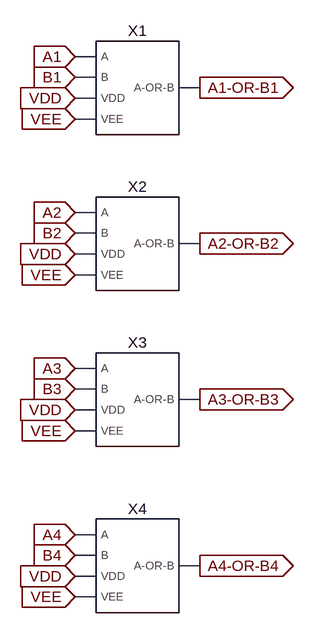
[diagram p0: schematic 4_Bit_OR_Symbol.asc]
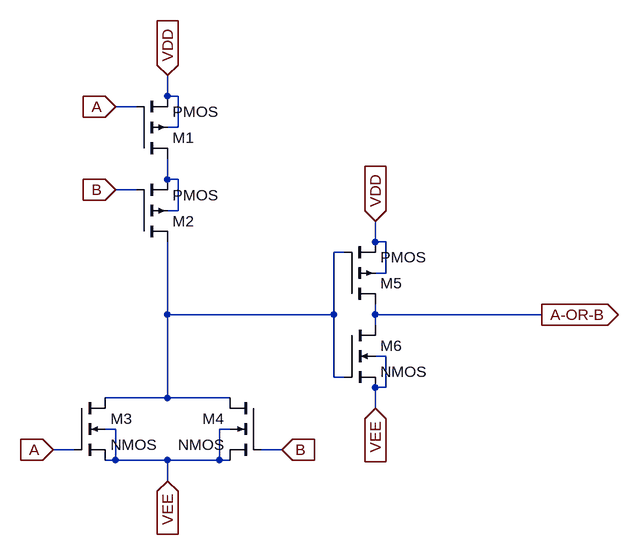
[diagram p1: sub-circuit 2_input_or_gate_symbol.asc]
4_Bit_OR_Symbol.asc, the LTspice schematic file:
Version 4
SHEET 1 1176 844
WIRE 704 -48 672 -48
WIRE 704 -16 672 -16
WIRE 864 0 832 0
WIRE 704 16 672 16
WIRE 704 48 672 48
WIRE 704 192 672 192
WIRE 704 224 672 224
WIRE 864 240 832 240
WIRE 704 256 672 256
WIRE 704 288 672 288
WIRE 704 432 672 432
WIRE 704 464 672 464
WIRE 864 480 832 480
WIRE 704 496 672 496
WIRE 704 528 672 528
WIRE 704 688 672 688
WIRE 704 720 672 720
WIRE 864 736 832 736
WIRE 704 752 672 752
WIRE 704 784 672 784
FLAG 672 -48 A1
IOPIN 672 -48 In
FLAG 672 16 VDD
IOPIN 672 16 In
FLAG 672 256 VDD
IOPIN 672 256 In
FLAG 672 496 VDD
IOPIN 672 496 In
FLAG 672 752 VDD
IOPIN 672 752 In
FLAG 672 -16 B1
IOPIN 672 -16 In
FLAG 672 192 A2
IOPIN 672 192 In
FLAG 672 224 B2
IOPIN 672 224 In
FLAG 672 432 A3
IOPIN 672 432 In
FLAG 672 464 B3
IOPIN 672 464 In
FLAG 672 688 A4
IOPIN 672 688 In
FLAG 672 720 B4
IOPIN 672 720 In
FLAG 864 0 A1-OR-B1
IOPIN 864 0 Out
FLAG 864 240 A2-OR-B2
IOPIN 864 240 Out
FLAG 864 480 A3-OR-B3
IOPIN 864 480 Out
FLAG 864 736 A4-OR-B4
IOPIN 864 736 Out
FLAG 672 48 VEE
IOPIN 672 48 In
FLAG 672 288 VEE
IOPIN 672 288 In
FLAG 672 528 VEE
IOPIN 672 528 In
FLAG 672 784 VEE
IOPIN 672 784 In
SYMBOL 2_Input_OR_Gate_Symbol 768 0 R0
SYMATTR InstName X1
SYMBOL 2_Input_OR_Gate_Symbol 768 240 R0
SYMATTR InstName X2
SYMBOL 2_Input_OR_Gate_Symbol 768 480 R0
SYMATTR InstName X3
SYMBOL 2_Input_OR_Gate_Symbol 768 736 R0
SYMATTR InstName X4

2_input_or_gate_symbol.asc, the sub-circuit schematic file:
Version 4
SHEET 1 1612 1096
WIRE 912 416 912 384
WIRE 928 416 912 416
WIRE 864 432 832 432
WIRE 928 464 928 416
WIRE 928 464 912 464
WIRE 912 544 912 512
WIRE 928 544 912 544
WIRE 864 560 832 560
WIRE 928 592 928 544
WIRE 928 592 912 592
WIRE 1232 640 1232 608
WIRE 1248 640 1232 640
WIRE 1184 656 1168 656
WIRE 1248 688 1248 640
WIRE 1248 688 1232 688
WIRE 912 752 912 640
WIRE 1168 752 1168 656
WIRE 1168 752 912 752
WIRE 1232 752 1232 736
WIRE 1488 752 1232 752
WIRE 1232 768 1232 752
WIRE 1248 816 1232 816
WIRE 1168 848 1168 752
WIRE 1184 848 1168 848
WIRE 1248 864 1248 816
WIRE 1248 864 1232 864
WIRE 912 880 912 752
WIRE 912 880 816 880
WIRE 1008 880 912 880
WIRE 1232 896 1232 864
WIRE 832 928 816 928
WIRE 1008 928 992 928
WIRE 768 960 736 960
WIRE 1088 960 1056 960
WIRE 832 976 832 928
WIRE 832 976 816 976
WIRE 912 976 832 976
WIRE 992 976 992 928
WIRE 992 976 912 976
WIRE 1008 976 992 976
WIRE 912 1008 912 976
FLAG 912 384 VDD
IOPIN 912 384 In
FLAG 912 1008 VEE
IOPIN 912 1008 In
FLAG 1232 896 VEE
IOPIN 1232 896 In
FLAG 1232 608 VDD
IOPIN 1232 608 In
FLAG 1488 752 A-OR-B
IOPIN 1488 752 Out
FLAG 832 432 A
IOPIN 832 432 In
FLAG 736 960 A
IOPIN 736 960 In
FLAG 1088 960 B
IOPIN 1088 960 In
FLAG 832 560 B
IOPIN 832 560 In
SYMBOL pmos4 864 512 M180
SYMATTR InstName M1
SYMBOL pmos4 864 640 M180
SYMATTR InstName M2
SYMBOL nmos4 768 880 R0
SYMATTR InstName M3
SYMBOL nmos4 1056 880 M0
SYMATTR InstName M4
SYMBOL pmos4 1184 736 M180
SYMATTR InstName M5
SYMBOL nmos4 1184 768 R0
SYMATTR InstName M6

The netlist it stands for:
* 4_Bit_OR_Symbol.asc
XX1 A1 B1 VDD VEE A1-OR-B1 2_input_or_gate_symbol
XX2 A2 B2 VDD VEE A2-OR-B2 2_input_or_gate_symbol
XX3 A3 B3 VDD VEE A3-OR-B3 2_input_or_gate_symbol
XX4 A4 B4 VDD VEE A4-OR-B4 2_input_or_gate_symbol

* block symbol definitions
.subckt 2_input_or_gate_symbol A B VDD VEE A-OR-B
M1 N001 A VDD VDD PMOS
M2 N002 B N001 N001 PMOS
M3 N002 A VEE VEE NMOS
M4 N002 B VEE VEE NMOS
M5 A-OR-B N002 VDD VDD PMOS
M6 A-OR-B N002 VEE VEE NMOS
.ends 2_input_or_gate_symbol

.model NMOS NMOS
.model PMOS PMOS
.lib standard.mos
.backanno
.end